# Altium project Gas sensor.PrjPcb
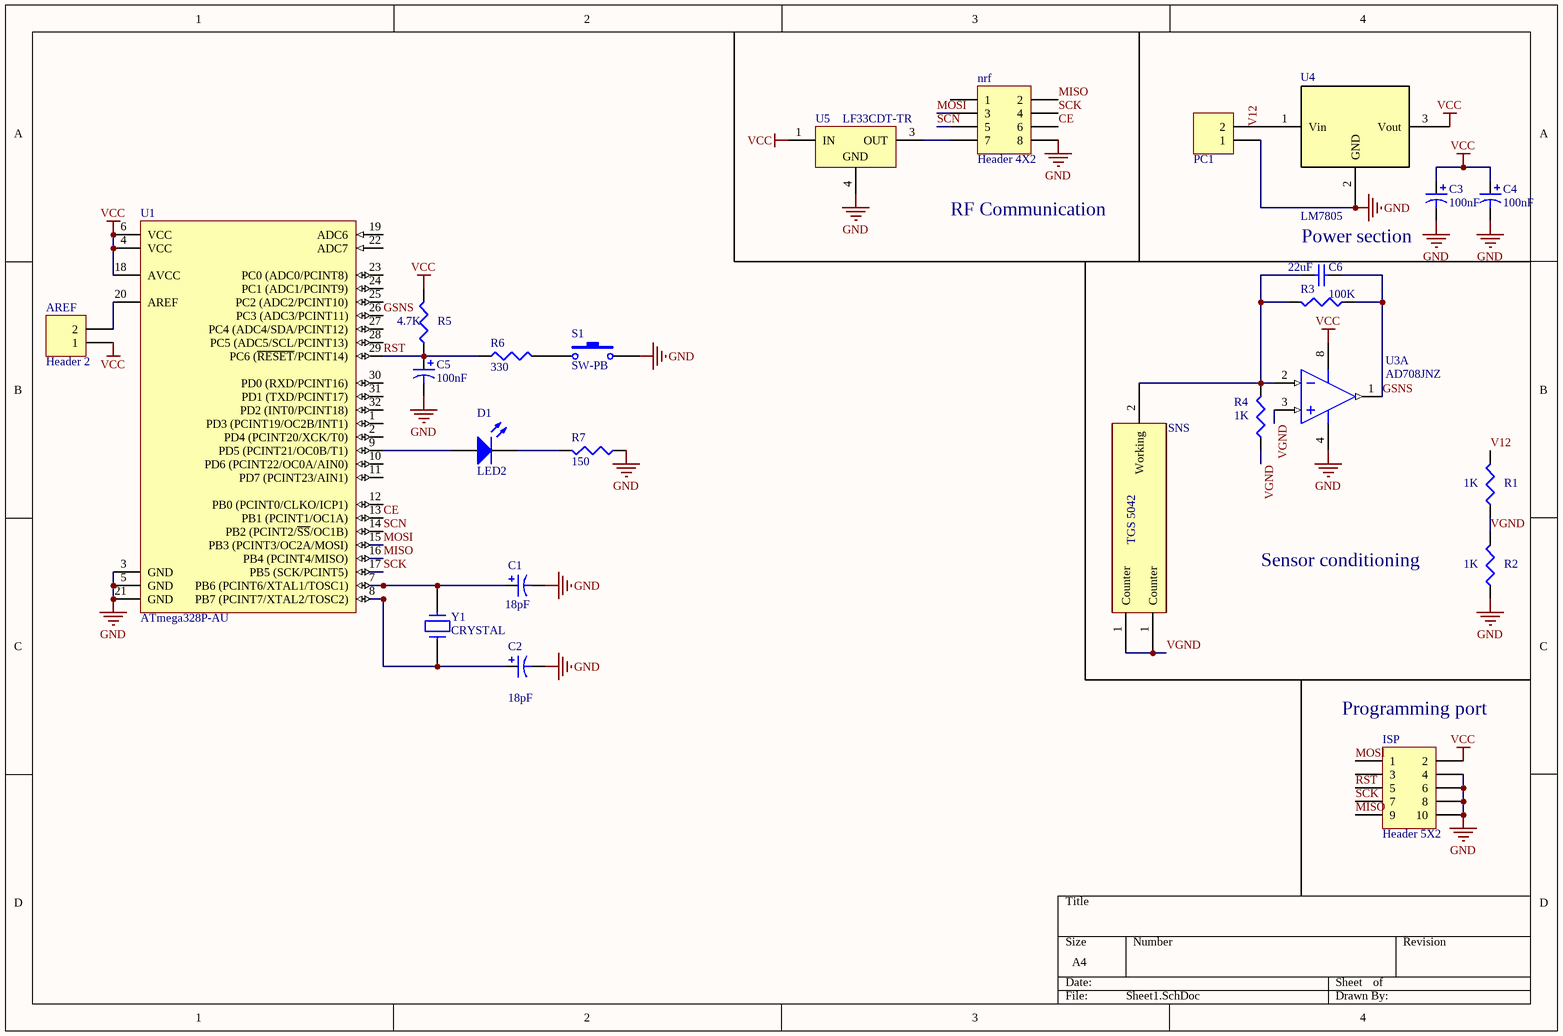
[diagram p0: Sheet1.SchDoc]
1 sheet, 25 parts. Net scope: global (net labels, ports and power ports of the same name join across sheets).
Board file: PCB1.PcbDoc

## Sheet Sheet1.SchDoc
size A4

### Parts
AREF  Header 2  [HDR1X2]
C1  value 18pF  [Resistor]  (hidden comment: Cap Pol3)
C2  value 18pF  [Resistor]  (hidden comment: Cap Pol3)
C3  value 100nF  [Resistor]  (hidden comment: Cap Pol3)
C4  value 100nF  [Resistor]  (hidden comment: Cap Pol3)
C5  value 100nF  [Resistor]  (hidden comment: Cap Pol3)
C6  22uF  [RB.1/.3]
D1  LED2  [3.2X1.6X1.1]
ISP  Header 5X2  [HDR2X5]
nrf  Header 4X2  [HDR2X4]
PC1  Power Connector  [My_ Power_Connector]  (value not drawn)
R1  value 1K  [Resistor]  (hidden comment: Rsepehr)
R2  value 1K  [Resistor]  (hidden comment: Rsepehr)
R3  value 100K  [Resistor]  (hidden comment: Rsepehr)
R4  value 1K  [Resistor]  (hidden comment: Rsepehr)
R5  value 4.7K  [Resistor]  (hidden comment: Rsepehr)
R6  value 330  [Resistor]  (hidden comment: Rsepehr)
R7  value 150  [Resistor]  (hidden comment: Rsepehr)
S1  SW-PB  [SPST-2]
SNS  Component_1  [GSPAK]  (value not drawn)
U1  ATmega328P-AU  [32A_N]
U3  AD708JNZ  [ADI-N-8]  (part A of 2)
U4  LM7805  [TO-220]
U5  LF33CDT-TR  [TO-252_N]
Y1  CRYSTAL  [My_Crystal]

### Nets
GND: C1.2 C2.2 C3.2 C4.2 C5.2 ISP.4 ISP.6 ISP.8 ISP.10 nrf.8 PC1.1 R2.1 R7.1 S1.2 U1.3(GND) U1.5(GND) U1.21(GND) U3.4(-VS) U4.2(GND) U5.4(GND)
VCC: AREF.1 C3.1 C4.1 ISP.2 R5.2 U1.4(VCC) U1.6(VCC) U1.18(AVCC) U3.8(+VS) U4.3(Vout) U5.1(IN)
CE: nrf.6 U1.13(PB1_(PCINT1/OC1A))
GSNS: C6.2 R3.1 U1.26(PC3_(ADC3/PCINT11)) U3.1(OUT_A)
MISO: ISP.9 nrf.2 U1.16(PB4_(PCINT4/MISO))
MOSI: ISP.1 nrf.3 U1.15(PB3_(PCINT3/OC2A/MOSI))
RST: C5.1 ISP.5 R5.1 R6.1 U1.29(PC6_(~{RESET}/PCINT14))
SCK: ISP.7 nrf.4 U1.17(PB5_(SCK/PCINT5))
SCN: nrf.5 U1.14(PB2_(PCINT2/~{SS}/OC1B))
V12: PC1.2 R1.2 U4.1(Vin)
VGND: R1.1 R2.2 R4.1 SNS.1(Counter) U3.3(+IN_A)
NetAREF_2: AREF.2 U1.20(AREF)
NetC1_1: C1.1 U1.7(PB6_(PCINT6/XTAL1/TOSC1)) Y1.2
NetC2_1: C2.1 U1.8(PB7_(PCINT7/XTAL2/TOSC2)) Y1.1
NetC6_1: C6.1 R3.2 R4.2 SNS.2(Working) U3.2(-IN_A)
NetD1_1: D1.1(A) U1.9(PD5_(PCINT21/OC0B/T1))
NetD1_2: D1.2(K) R7.2
Netnrf_7: nrf.7 U5.3(OUT)
NetR6_2: R6.2 S1.1

Not connected (* = marked no-connect by the designer): ISP 3; nrf 1; U1 1(PD3_(PCINT19/OC2B/INT1)) 2(PD4_(PCINT20/XCK/T0)) 10(PD6_(PCINT22/OC0A/AIN0)) 11(PD7_(PCINT23/AIN1)) 12(PB0_(PCINT0/CLKO/ICP1)) 19(ADC6) 22(ADC7) 23(PC0_(ADC0/PCINT8)) 24(PC1_(ADC1/PCINT9)) 25(PC2_(ADC2/PCINT10)) 27(PC4_(ADC4/SDA/PCINT12)) 28(PC5_(ADC5/SCL/PCINT13)) 30(PD0_(RXD/PCINT16)) 31(PD1_(TXD/PCINT17)) 32(PD2_(INT0/PCINT18))

### Notes on the sheet
- RF Communication
- Power section
- Sensor conditioning
- (near ISP) Programming port
- (in symbol Component_1) TGS 5042

### Library data of the parts
AREF = Header 2: Header, 2-Pin; LatestRevisionDate: 17-Jul-2002; LatestRevisionNote: Re-released for DXP Platform.; Publisher: Altium Limited
C1-C5 = Cap Pol3: Polarized Capacitor (Surface Mount); Published: 8-Jun-2000; LatestRevisionDate: 29-May-2009; LatestRevisionNote: IPC-7351 Footprint Added.; PackageReference: C0805; Publisher: Altium Limited; PackageDescription: Chip Capacitor
C6 = Cap Semi: Capacitor (Semiconductor SIM Model); Published: 8-Jun-2000; LatestRevisionDate: 29-May-2009; LatestRevisionNote: IPC-7351 Footprint Added.; PackageReference: C1206; Publisher: Altium Limited; PackageDescription: Chip Capacitor
D1 = LED2: Typical RED, GREEN, YELLOW, AMBER GaAs LED; Published: 8-Jun-2000; LatestRevisionDate: 17-Jul-2002; LatestRevisionNote: Re-released for DXP Platform.; PackageVersion: Feb-2002; PackageReference: 3.2X1.6X1.1; Publisher: Altium Limited; PackageDescription: SM LED; 2 Flat Leads
ISP = Header 5X2: Header, 5-Pin, Dual row; LatestRevisionDate: 17-Jul-2002; LatestRevisionNote: Re-released for DXP Platform.; Publisher: Altium Limited
nrf = Header 4X2: Header, 4-Pin, Dual row; LatestRevisionDate: 17-Jul-2002; LatestRevisionNote: Re-released for DXP Platform.; Publisher: Altium Limited
PC1 = Power Connector: white Power Connector
R1-R7 = Res3: Resistor; Published: 8-Jun-2000; LatestRevisionDate: 29-May-2009; LatestRevisionNote: IPC-7351 Footprint Added.; PackageReference: J1-0603; Publisher: Altium Limited; PackageDescription: Chip Resistor
S1 = SW-PB: Switch; Published: 24-Mar-1999; LatestRevisionDate: 17-Jul-2002; LatestRevisionNote: Re-released for DXP Platform.; PackageReference: SPST-2; Publisher: Altium Limited; PackageDescription: Switch; 2 Leads
U1 = ATmega328P-AU: 8-bit AVR Microcontroller, 32KB Flash, 1KB EEPROM, 2KB SRAM, 32-pin TQFP, Industrial Grade (-40°C to 85°C); DatasheetVersion: revD, May-2011; PackageVersion: revC, Oct-2010; PackageReference: 32A; PackageDescription: 32-Lead, 7x7x1.0 mm Body, 0.8mm Lead Pitch, Thin Profile Plastic Quad Flat Package (TQFP); Code_JEDEC: MS-026-ABA; ComponentLink1Description: Manufacturer URL; ComponentLink1URL: http://www.atmel.com/; ComponentLink2Description: ATmega48A/48PA/88A/88PA/168A/168PA/328/328P Datasheet; ComponentLink2URL: http://www.atmel.com/dyn/resources/prod_documents/doc8271.pdf; ComponentLink3Description: ATmega48A/48PA/88A/88PA/168A/168PA/328/328P Summary; ComponentLink3URL: http://www.atmel.com/dyn/resources/prod_documents/8271S.pdf
U3 = AD708JNZ: Double Channel Very High DC Precision Operational Amplifier, 900KHz BW, 300 mV/us SR, Commercial, 8-pin DIP (N-8), Tube; Generic Part Number: AD708; Manufacturer: Analog Devices; Amplifiers Per Package: 2; Input Bias Current: 1nA; Input Offset Voltage: 30uV; Iq/Amp: 2.75mA; V Span Max: 36V; V Span Min: 6V; DatasheetVersion: Rev. C; PackageVersion: 070606-A; PackageReference: N-8; PackageDescription: 8-Pin Plastic Dual In-Line Package, Row spacing 7.62 mm, Pitch 2.54 mm; Supplier 1: Digi-Key; Supplier Part Number 1: AD708JNZ-ND; Supplier 2: Farnell; Supplier Part Number 2: 9604766; Supplier 3: Newark; Supplier Part Number 3: 59K4537; Packing: Tube; Slew Rate: 300mV/us; Small Signal Bandwidth: 900KHz; Mounting Technology: Through Hole; Code_JEDEC: MS-001; PartNumber: AD708JNZ; ComponentLink1Description: Manufacturer URL; ComponentLink1URL: http://www.analog.com/en/index.html; ComponentLink2Description: Datasheet; ComponentLink2URL: http://www.analog.com/static/imported-files/data_sheets/AD708.pdf; ComponentLink3Description: Package Specification; ComponentLink3URL: http:/www.analog.com/static/imported-files/packages/PKG_PDF/PDIP(N)/N_8.pdf
U4 = Component_1
U5 = LF33CDT-TR: 500mA, Very Low Drop (0.45V) Voltage Regulator, 3.3V, 3-Pin DPAK, Tape and Reel; DatasheetVersion: Nov-2010; PackageVersion: 2011; PackageReference: TO-252; PackageDescription: 3-Pin Transistor Outline Package 2.28 mm Pitch, 9.7 mm Lead Span (DPAK); PartNumber: LF33CDT-TR; ComponentLink1Description: Manufacturer URL; ComponentLink1URL: http://www.st.com; ComponentLink2Description: Datasheet; ComponentLink2URL: http://www.st.com/internet/com/TECHNICAL_RESOURCES/TECHNICAL_LITERATURE/DATASHEET/CD00000546.pdf